# Altium schematic sheet L5.SchDoc
size A4
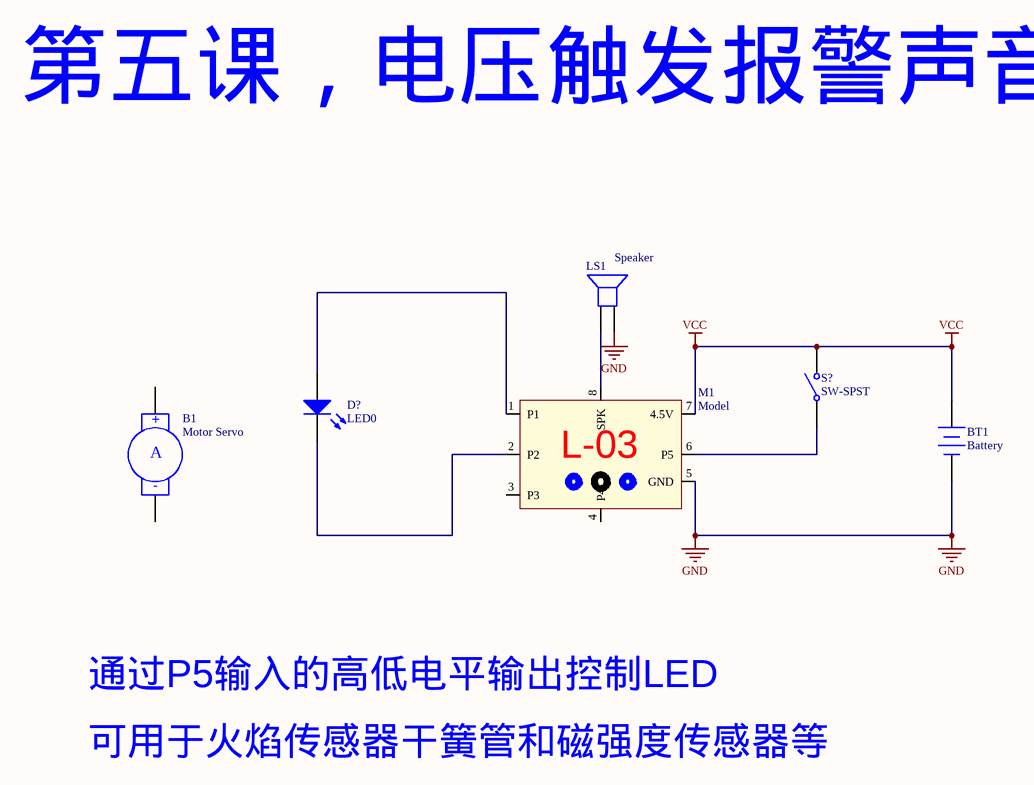
[diagram p0: L5.SchDoc]

## Parts
B1  Motor Servo  [RAD-0.4]
BT1  Battery  [BAT-2]
D?  LED0  [LED-0]
LS1  Speaker  [PIN2]
M1  Model
S?  SW-SPST  [SPST-2]

## Nets
GND: BT1.2(-) LS1.2 M1.5(GND)
VCC: BT1.1(+) M1.7(4.5V) S?.2(NO)
NetD?_1: D?.1(A) M1.1(P1)
NetD?_2: D?.2(K) M1.2(P2)
NetLS1_1: LS1.1 M1.8(SPK)
NetM1_6: M1.6(P5) S?.1(COMMON)

Not connected (* = marked no-connect by the designer): B1 1(+) 2(-); M1 3(P3) 4(P4)

## Notes on the sheet
- Labels drawn without touching a wire or pin: L-03, 可用于火焰传感器干簧管和磁强度传感器等, 第五课，电压触发报警声音输出, 通过P5输入的高低电平输出控制LED
- (in symbol Motor Servo) A

## Library data of the parts
B1 = Motor Servo: Servo Motor; Published: 24-Mar-1999; LatestRevisionDate: 17-Jul-2002; LatestRevisionNote: Re-released for DXP Platform.; PackageReference: RAD-0.4; Publisher: Altium Limited; PackageDescription: Radial Cap, Thru-Hole; 2 Leads; 0.4 in Pin Spacing
BT1 = Battery: Multicell Battery; Published: 24-Mar-1999; LatestRevisionDate: 17-Jul-2002; LatestRevisionNote: Re-released for DXP Platform.; PackageReference: BAT-2; Publisher: Altium Limited; PackageDescription: Battery; 2 Leads
D? = LED0: Typical INFRARED GaAs LED; Published: 8-Jun-2000; LatestRevisionDate: 08-Jul-2005; LatestRevisionNote: Mech Layer 1 removed.; PackageReference: LED-0; Publisher: Altium Limited; PackageDescription: LED; 2 Leads
LS1 = Speaker: Loudspeaker; Published: 24-Mar-1999; LatestRevisionDate: 17-Jul-2002; LatestRevisionNote: Re-released for DXP Platform.; PackageReference: PIN2; Publisher: Altium Limited
M1 = M?: 积木模块
S? = SW-SPST: Single-Pole, Single-Throw Switch; Published: 24-Mar-1999; LatestRevisionDate: 17-Jul-2002; LatestRevisionNote: Re-released for DXP Platform.; PackageReference: SPST-2; Publisher: Altium Limited; PackageDescription: Switch; 2 Leads